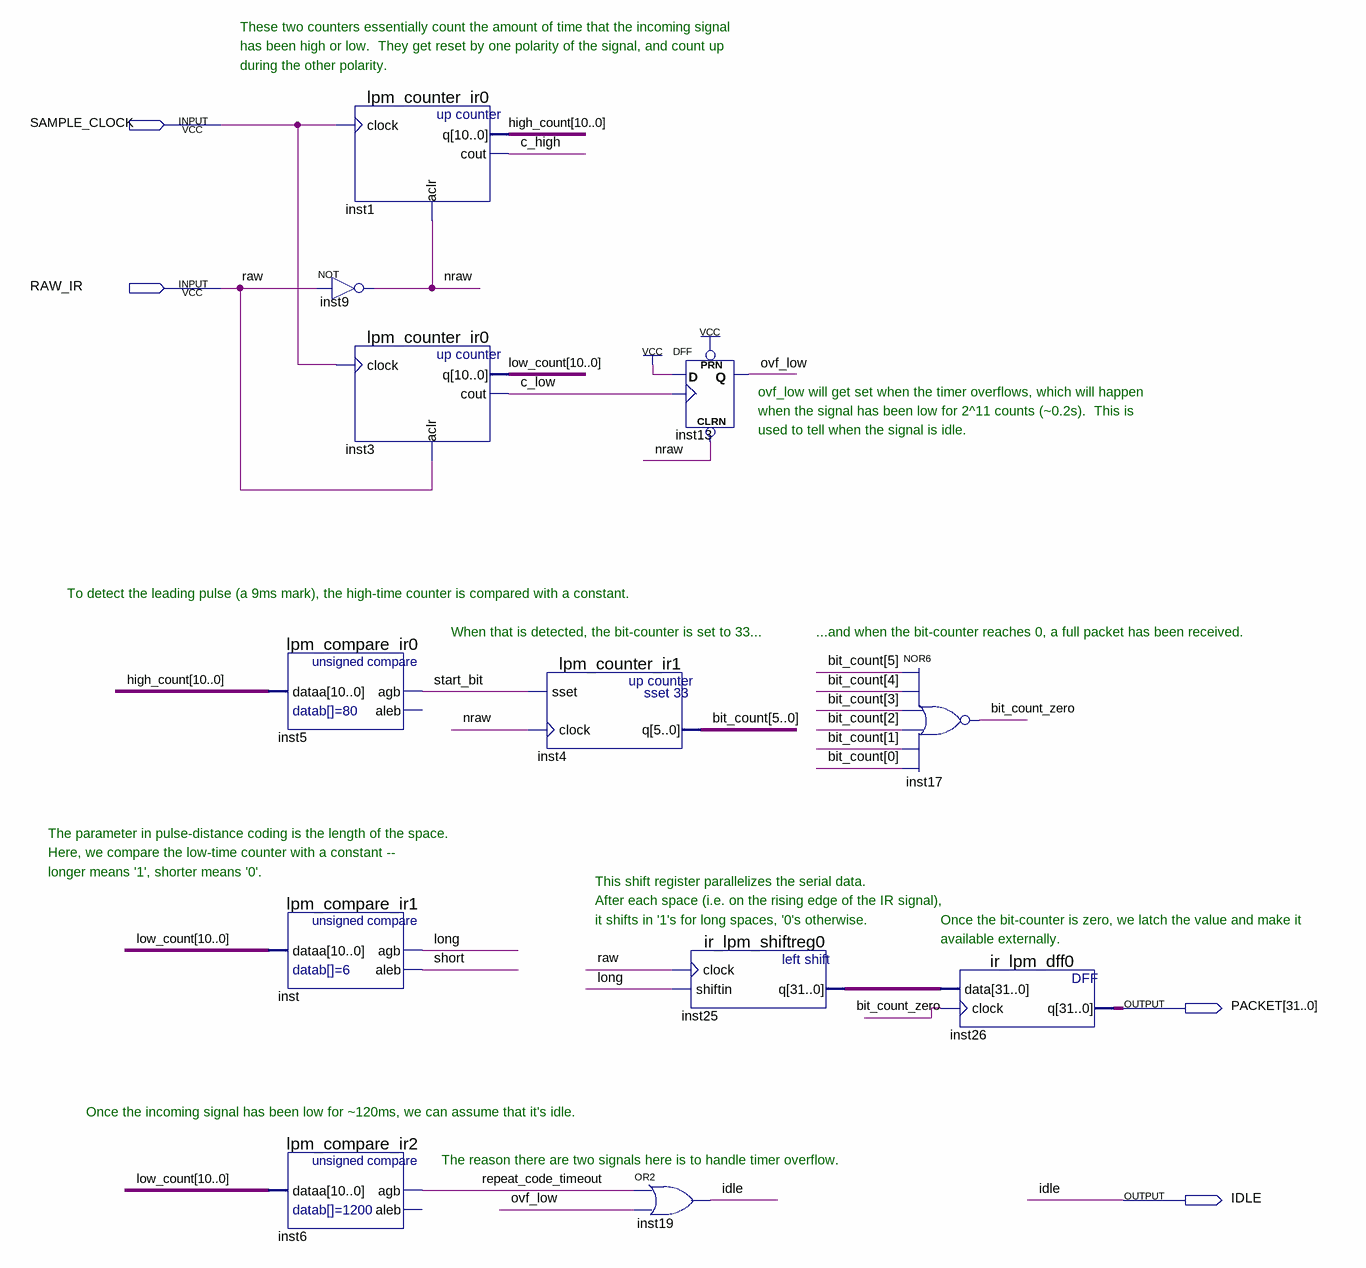
[diagram p0: schematic sheet]
// Quartus schematic IR_RCVR.bdf as structural Verilog: 12 symbols, 4 pins
module IR_RCVR (
  input  SAMPLE_CLOCK,
  input  RAW_IR,
  output [31:0] PACKET,
  output IDLE
);

  wire bit_count_zero, c_high, c_low, long, nraw, ovf_low, repeat_code_timeout, short, start_bit;
  wire [5:0] bit_count;
  wire [10:0] high_count, low_count;
  wire [31:0] inst25_q;

  not inst9 (nraw, RAW_IR);
  lpm_compare_ir0 inst5 (.dataa(high_count), .agb(start_bit));  // open: aleb
  lpm_compare_ir1 inst (.dataa(low_count), .agb(long), .aleb(short));
  lpm_compare_ir2 inst6 (.dataa(low_count), .agb(repeat_code_timeout));  // open: aleb
  lpm_counter_ir0 inst1 (.clock(SAMPLE_CLOCK), .aclr(nraw), .q(high_count), .cout(c_high));
  lpm_counter_ir0 inst3 (.clock(SAMPLE_CLOCK), .aclr(RAW_IR), .q(low_count), .cout(c_low));
  lpm_counter_ir1 inst4 (.sset(start_bit), .clock(nraw), .q(bit_count));
  or inst19 (IDLE, repeat_code_timeout, ovf_low);
  DFF inst13 (.CLRN(nraw), .CLK(c_low), .D(1'b1), .PRN(1'b1), .Q(ovf_low));
  ir_lpm_shiftreg0 inst25 (.clock(RAW_IR), .shiftin(long), .q(inst25_q));
  nor inst17 (bit_count_zero, bit_count[5], bit_count[4], bit_count[3], bit_count[2], bit_count[1], bit_count[0]);
  ir_lpm_dff0 inst26 (.data(inst25_q), .clock(bit_count_zero), .q(PACKET));

  // Other names for the same wires on the sheet: raw = RAW_IR

  // Notes on the sheet:
  //   These two counters essentially count the amount of time that the incoming signal
  //   has been high or low.  They get reset by one polarity of the signal, and count up
  //   during the other polarity.
  //   ovf_low will get set when the timer overflows, which will happen
  //   when the signal has been low for 2^11 counts (~0.2s).  This is
  //   used to tell when the signal is idle.
  //   To detect the leading pulse (a 9ms mark), the high-time counter is compared with a constant.
  //   When that is detected, the bit-counter is set to 33...
  //   ...and when the bit-counter reaches 0, a full packet has been received.
  //   The parameter in pulse-distance coding is the length of the space.
  //   Here, we compare the low-time counter with a constant --
  //   longer means '1', shorter means '0'.
  //   This shift register parallelizes the serial data.
  //   After each space (i.e. on the rising edge of the IR signal),
  //   it shifts in '1's for long spaces, '0's otherwise.
  //   Once the bit-counter is zero, we latch the value and make it
  //   available externally.
  //   Once the incoming signal has been low for ~120ms, we can assume that it's idle.
  //   The reason there are two signals here is to handle timer overflow.
endmodule
